# Altium schematic sheet IC723.schdoc
size 191 x 182 mm
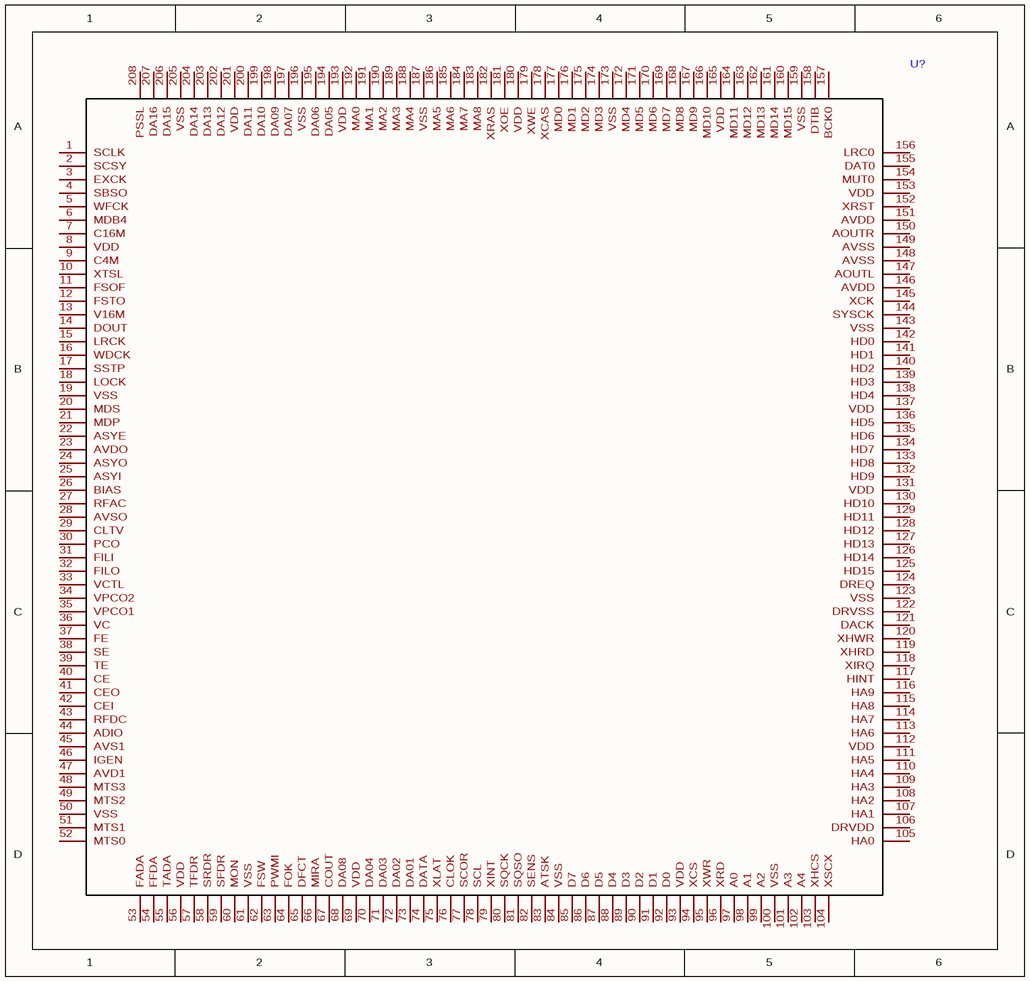
[diagram p0: IC723.schdoc]

## Parts
U?  (no value)  [LQFP-208_L28.0-W28.0-P0.50-LS30.0-BL]

## Nets

Not connected (* = marked no-connect by the designer): U? 1(SCLK) 2(SCSY) 3(EXCK) 4(SBSO) 5(WFCK) 6(MDB4) 7(C16M) 8(VDD) 9(C4M) 10(XTSL) 11(FSOF) 12(FSTO) 13(V16M) 14(DOUT) 15(LRCK) 16(WDCK) 17(SSTP) 18(LOCK) 19(VSS) 20(MDS) 21(MDP) 22(ASYE) 23(AVDO) 24(ASYO) 25(ASYI) 26(BIAS) 27(RFAC) 28(AVSO) 29(CLTV) 30(PCO) 31(FILI) 32(FILO) 33(VCTL) 34(VPCO2) 35(VPCO1) 36(VC) 37(FE) 38(SE) 39(TE) 40(CE) 41(CEO) 42(CEI) 43(RFDC) 44(ADIO) 45(AVS1) 46(IGEN) 47(AVD1) 48(MTS3) 49(MTS2) 50(VSS) 51(MTS1) 52(MTS0) 53(FADA) 54(FFDA) 55(TADA) 56(VDD) 57(TFDR) 58(SRDR) 59(SFDR) 60(MON) 61(VSS) 62(FSW) 63(PWMI) 64(FOK) 65(DFCT) 66(MIRA) 67(COUT) 68(DA08) 69(VDD) 70(DA04) 71(DA03) 72(DA02) 73(DA01) 74(DATA) 75(XLAT) 76(CLOK) 77(SCOR) 78(SCL) 79(XINT) 80(SQCK) 81(SQSO) 82(SENS) 83(ATSK) 84(VSS) 85(D7) 86(D6) 87(D5) 88(D4) 89(D3) 90(D2) 91(D1) 92(D0) 93(VDD) 94(XCS) 95(XWR) 96(XRD) 97(A0) 98(A1) 99(A2) 100(VSS) 101(A3) 102(A4) 103(XHCS) 104(XSCX) 105(HA0) 106(DRVDD) 107(HA1) 108(HA2) 109(HA3) 110(HA4) 111(HA5) 112(VDD) 113(HA6) 114(HA7) 115(HA8) 116(HA9) 117(HINT) 118(XIRQ) 119(XHRD) 120(XHWR) 121(DACK) 122(DRVSS) 123(VSS) 124(DREQ) 125(HD15) 126(HD14) 127(HD13) 128(HD12) 129(HD11) 130(HD10) 131(VDD) 132(HD9) 133(HD8) 134(HD7) 135(HD6) 136(HD5) 137(VDD) 138(HD4) 139(HD3) 140(HD2) 141(HD1) 142(HD0) 143(VSS) 144(SYSCK) 145(XCK) 146(AVDD) 147(AOUTL) 148(AVSS) 149(AVSS) 150(AOUTR) 151(AVDD) 152(XRST) 153(VDD) 154(MUT0) 155(DAT0) 156(LRC0) 157(BCK0) 158(DTIB) 159(VSS) 160(MD15) 161(MD14) 162(MD13) 163(MD12) 164(MD11) 165(VDD) 166(MD10) 167(MD9) 168(MD8) 169(MD7) 170(MD6) 171(MD5) 172(MD4) 173(VSS) 174(MD3) 175(MD2) 176(MD1) 177(MD0) 178(XCAS) 179(XWE) 180(VDD) 181(XOE) 182(XRAS) 183(MA8) 184(MA7) 185(MA6) 186(MA5) 187(VSS) 188(MA4) 189(MA3) 190(MA2) 191(MA1) 192(MA0) 193(VDD) 194(DA05) 195(DA06) 196(VSS) 197(DA07) 198(DA09) 199(DA10) 200(DA11) 201(VDD) 202(DA12) 203(DA13) 204(DA14) 205(VSS) 206(DA15) 207(DA16) 208(PSSL)

## Library data of the parts
U? = IC723